# EAGLE schematic ckt1 (EAGLE 9.6.0)
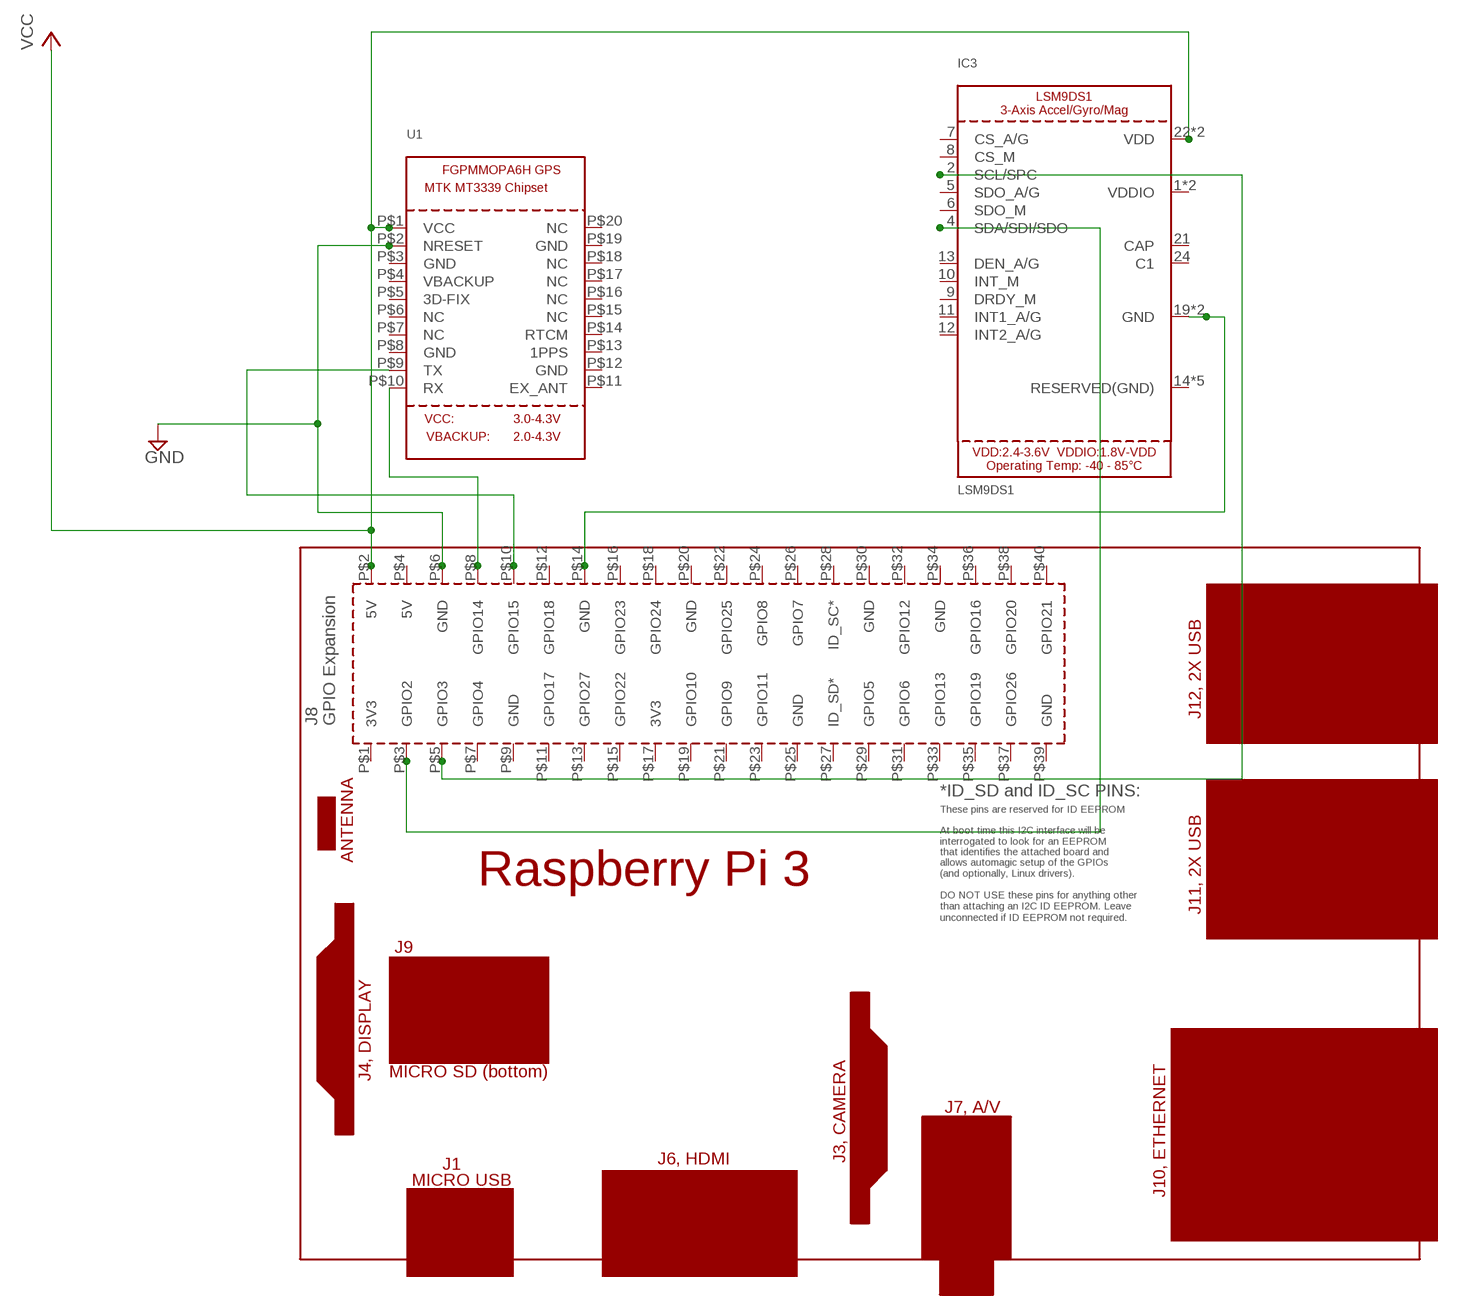
[diagram p0: schematic, sheet 1]

## Parts
IC3  LSM9DS1  [LGA24_3.5X3.1MM]
PCB1  RPI3RPI3  [RPI3]
U1  GPS_FGPMMOPA6H  [FGPMMOPA6H]

## Nets
GND: PCB1.P$6(GND) U1.P$2(NRESET)
N$3: PCB1.P$10(GPIO15) U1.P$9(TX)
N$4: PCB1.P$8(GPIO14) U1.P$10(RX)
N$5: IC3.19(GND) IC3.20(GND) PCB1.P$14(GND)
N$6: IC3.4(SDA/SDI/SDO) PCB1.P$3(GPIO2)
N$7: IC3.2(SCL/SPC) PCB1.P$5(GPIO3)
VCC: IC3.22(VDD) IC3.23(VDD) PCB1.P$2(5V) U1.P$1(VCC)
Unconnected: IC3.5(SDO_A/G) IC3.6(SDO_M) IC3.7(CS_A/G) IC3.8(CS_M) IC3.9(DRDY_M) IC3.10(INT_M) IC3.11(INT1_A/G) IC3.12(INT2_A/G) IC3.13(DEN_A/G) IC3.21(CAP) IC3.24(C1) PCB1.P$1(3V3) PCB1.P$4(5V) PCB1.P$7(GPIO4) PCB1.P$9(GND) PCB1.P$11(GPIO17) PCB1.P$12(GPIO18) PCB1.P$13(GPIO27) PCB1.P$15(GPIO22) PCB1.P$16(GPIO23) PCB1.P$17(3V3) PCB1.P$18(GPIO24) PCB1.P$19(GPIO10) PCB1.P$20(GND) PCB1.P$21(GPIO9) PCB1.P$22(GPIO25) PCB1.P$23(GPIO11) PCB1.P$24(GPIO8) PCB1.P$25(GND) PCB1.P$26(GPIO7) PCB1.P$27(ID_SD*) PCB1.P$28(ID_SC*) PCB1.P$29(GPIO5) PCB1.P$30(GND) PCB1.P$31(GPIO6) PCB1.P$32(GPIO12) PCB1.P$33(GPIO13) PCB1.P$34(GND) PCB1.P$35(GPIO19) PCB1.P$36(GPIO16) PCB1.P$37(GPIO26) PCB1.P$38(GPIO20) PCB1.P$39(GND) PCB1.P$40(GPIO21) U1.P$3(GND) U1.P$4(VBACKUP) U1.P$5(3D-FIX) U1.P$6(NC) U1.P$7(NC) U1.P$8(GND) U1.P$11(EX_ANT) U1.P$12(GND) U1.P$13(1PPS) U1.P$14(RTCM) U1.P$15(NC) U1.P$16(NC) U1.P$17(NC) U1.P$18(NC) U1.P$19(GND) U1.P$20(NC)

## Power pins joined to a net without a drawn wire
RESERVED(GND): IC3.14(RESERVED(GND)) IC3.15(RESERVED(GND)) IC3.16(RESERVED(GND)) IC3.17(RESERVED(GND)) IC3.18(RESERVED(GND))
VDDIO: IC3.1(VDDIO) IC3.3(VDDIO)

## Library data of the parts
IC3 = microbuilder:LSM9DS1
PCB1 = e14_Rpi3_RevA+mirror-pcb:RPI3: Device for Raspberry Pi 3 board created by Dave Young for www.element14.com More information and support community is available at https://www.element14.com/community/community/raspberry-pi Device for Raspberry Pi 3 board updated by Gerald Schwarz for www.element14.com On RPI3 addet the layer milling and created a mirrored shield.
U1 = adafruit:GPS_FGPMMOPA6H: GPS Module - MTK MT3339 Chipset, -165dBm sensitivity, 22 channels, 10Hz, auto-select external antenna options